# Altium schematic sheet WS2812BDriver.SchDoc
size A4
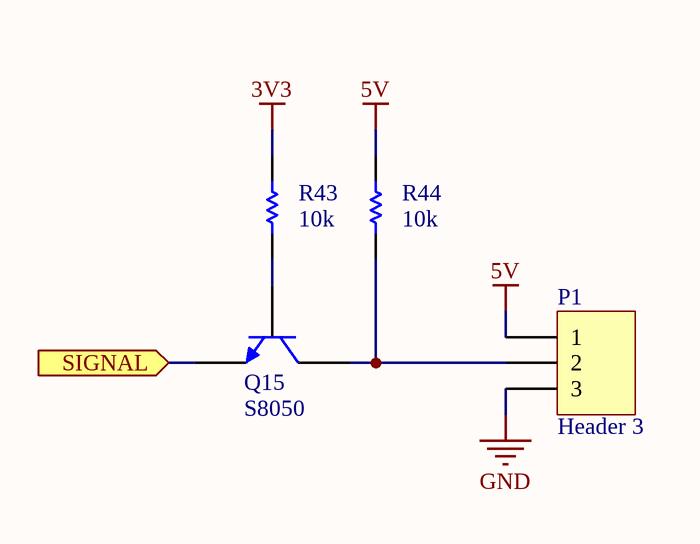
[diagram p0: WS2812BDriver.SchDoc]

## Parts
P1  Header 3  [HDR1X3]
Q15  S8050  [SOT23-3M]
R43  value 10k  [J1-0603]  (hidden comment: Res1)
R44  value 10k  [J1-0603]  (hidden comment: Res1)

## Ports
SIGNAL (in)

## Nets
3V3: R43.2
5V: P1.1 R44.2
GND: P1.3
SIGNAL: Q15.2(E) ; port SIGNAL
NetP1_2: P1.2 Q15.3(C) R44.1
NetQ15_1: Q15.1(B) R43.1

## Library data of the parts
P1 = Header 3: Header, 3-Pin; LatestRevisionDate: 17-Jul-2002; LatestRevisionNote: Re-released for DXP Platform.; Publisher: Altium Limited
Q15 = S8050: NPN General Purpose Amplifier; Published: 8-Jun-2000; LatestRevisionDate: 15-Jan-2003; LatestRevisionNote: PCB Footprint 'BCY-W3/D4.7' replaced; DatasheetVersion: 1997; PackageVersion: Sep-1998; PackageReference: TO-92A; Publisher: Altium Limited; PackageDescription: TO, Flat Index; 3 In-Line, Axial Leads; Body Dia. 4.5mm; Leads 0.51 x 0.48 mm (max); LCSC: C259988
R43 R44 = Res1: Resistor; Published: 8-Jun-2000; LatestRevisionDate: 17-Jul-2002; LatestRevisionNote: Re-released for DXP Platform.; PackageReference: AXIAL-0.3; Publisher: Altium Limited; PackageDescription: Axial Device, Thru-Hole; 2 Leads; 0.3 in Pin Spacing